# Altium schematic sheet USART1.SchDoc
size A4
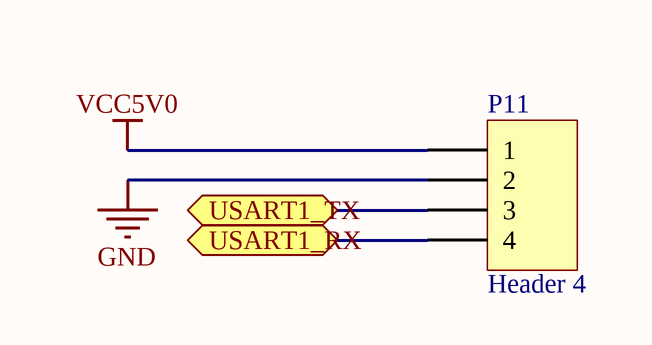
[diagram p0: USART1.SchDoc]

## Parts
P11  Header 4  [HDR1X4]

## Ports
USART1_RX, USART1_TX

## Nets
GND: P11.2
VCC5V0: P11.1
USART1_RX: P11.4 ; port USART1_RX
USART1_TX: P11.3 ; port USART1_TX

## Library data of the parts
P11 = Header 4: Header, 4-Pin; LatestRevisionDate: 17-Jul-2002; LatestRevisionNote: Re-released for DXP Platform.; Publisher: Altium Limited